# Altium schematic sheet LoadCell_Driver.SchDoc
size Letter; Author: Lihong; Chenwei; SheetNumber: 8; SheetTotal: 8
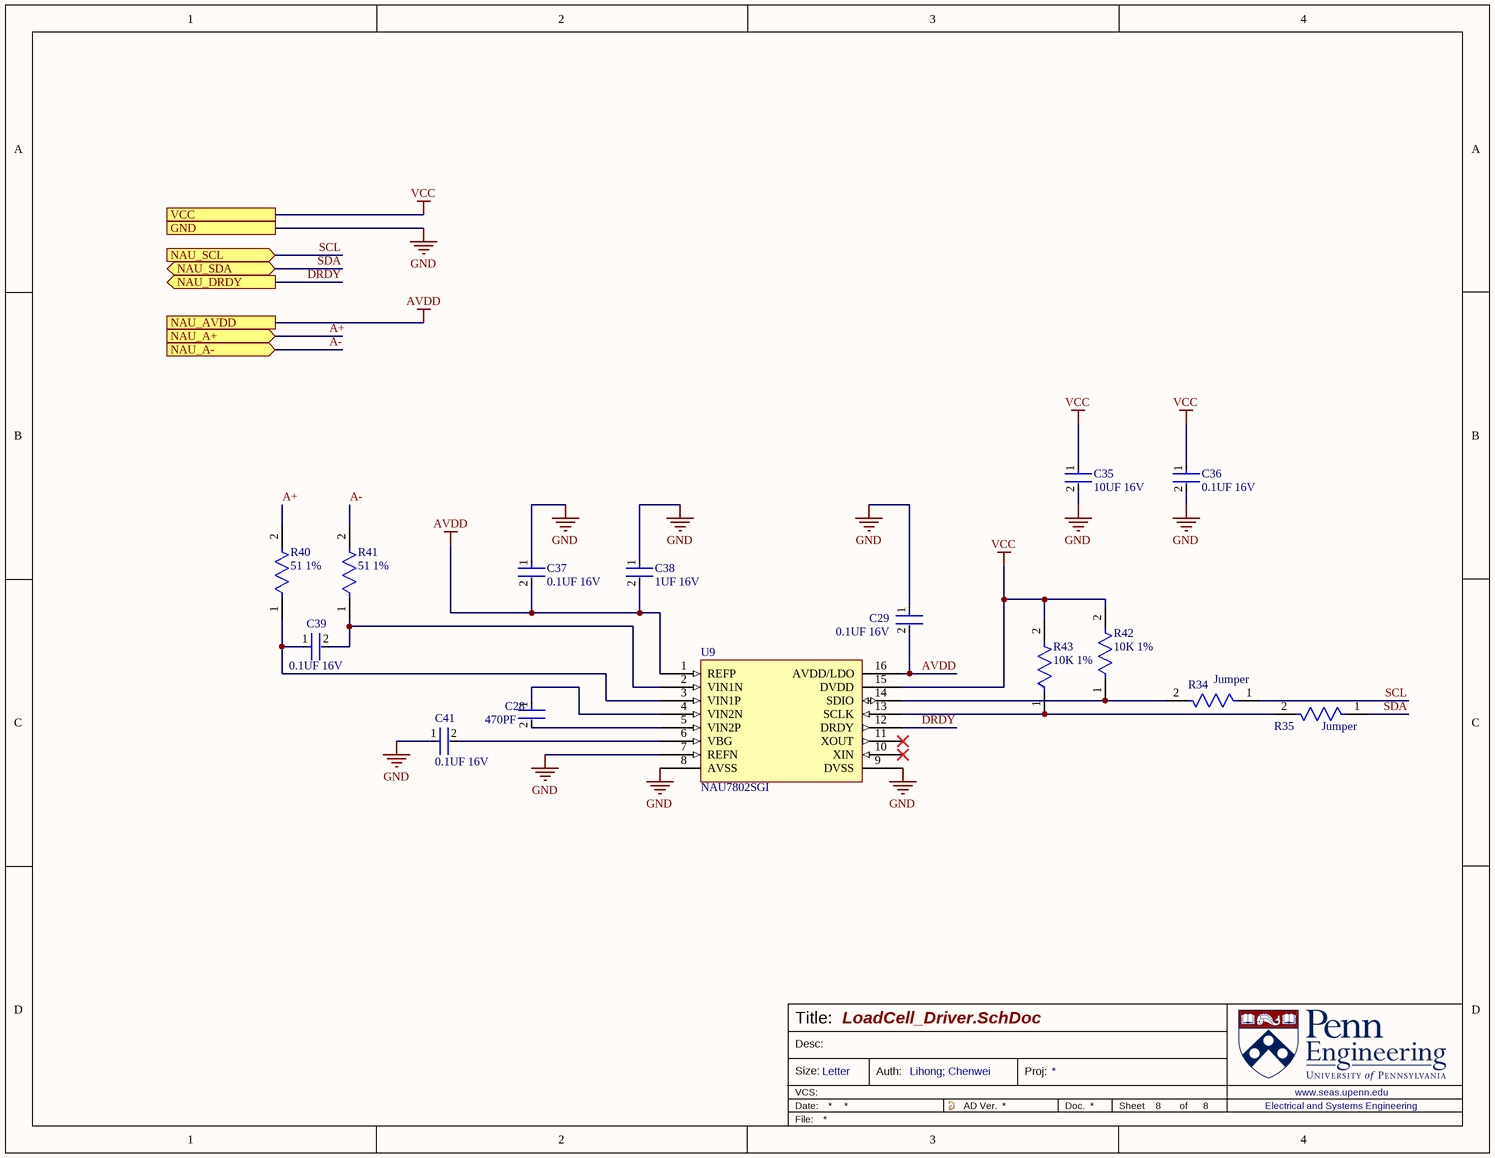
[diagram p0: LoadCell_Driver.SchDoc]

## Parts
C28  470PF  [FP-0402-L_1_0_1-W_0_5_0_1-IPC_A]
C29  0.1UF 16V  [FP-CC0402-MFG]
C35  10UF 16V  [FP-CC0603-DB-MFG]
C36  0.1UF 16V  [FP-CC0402-MFG]
C37  0.1UF 16V  [FP-CC0402-MFG]
C38  1UF 16V  [FP-CC0603-DA-MFG]
C39  0.1UF 16V  [FP-CC0402-MFG]
C41  0.1UF 16V  [FP-CC0402-MFG]
R34  Jumper  [FP-RMCF0603-MFG]
R35  Jumper  [FP-RMCF0603-MFG]
R40  51 1%  [FP-RMCF0402-IPC_C]
R41  51 1%  [FP-RMCF0402-IPC_C]
R42  10K 1%  [FP-RNCP0603-IPC_A]
R43  10K 1%  [FP-RNCP0603-IPC_A]
U9  NAU7802SGI  [SOP127P600X175-16N]

## Ports
GND, NAU_A+ (in), NAU_A- (in), NAU_AVDD, NAU_DRDY (out), NAU_SCL (in), NAU_SDA (bidir), VCC

## Nets
AVDD: C29.2 C37.2 C38.2 U9.1(REFP) U9.16(AVDD/LDO) ; port NAU_AVDD
GND: C29.1 C35.2 C36.2 C37.1 C38.1 C41.1 U9.7(REFN) U9.8(AVSS) U9.9(DVSS) ; port GND
VCC: C35.1 C36.1 R42.2 R43.2 U9.15(DVDD) ; port VCC
A+: R40.2 ; port NAU_A+
A-: R41.2 ; port NAU_A-
DRDY: U9.12(DRDY) ; port NAU_DRDY
SCL: R34.1 ; port NAU_SCL
SDA: R35.1 ; port NAU_SDA
NetC28_1: C28.1 U9.4(VIN2N)
NetC28_2: C28.2 U9.5(VIN2P)
NetC39_1: C39.1 R40.1 U9.3(VIN1P)
NetC39_2: C39.2 R41.1 U9.2(VIN1N)
NetC41_2: C41.2 U9.6(VBG)
NetR34_2: R34.2 R42.1 U9.14(SDIO)
NetR35_2: R35.2 R43.1 U9.13(SCLK)

Not connected (* = marked no-connect by the designer): U9 10(XIN)* 11(XOUT)*

## Notes on the sheet
- Title:
- Desc:
- Size:
- Letter
- Auth:
- Proj:
- Sheet
- of
- www.seas.upenn.edu
- Electrical and Systems Engineering

## Library data of the parts
C28 = CMP-1034-01502-3: General Purpose Ceramic Capacitor, 0402, 470pF, 10%, X7R, 15%, 50V; Series: -; Height: 0.5mm; Termination: SMD/SMT; Packaging: Tape and Reel; Tolerance: 10%; REACH SVHC: No SVHC; Package Quantity: 10000; Case Code (Imperial): 0402; Voltage: 50V; Depth: 0.5mm; Case Code (Metric): 1005; Voltage Rating: 50V; Radiation Hardening: No; Construction: Flat; Mount: Surface Mount; Dielectric: X7R; Min Operating Temperature: -55°C; Width: 0.5mm; Number of Pins: 2; Case/Package: 0402; RoHS Compliant: Yes; Thickness: 0.022inch; Lead Free: Lead Free; Voltage Rating (DC): 50V; Max Operating Temperature: 125°C; Capacitance: 470pF; Length: 1mm; Contact Plating: Tin
C29 C36 C37 C39 C41 = CMP-03422-000946-1: CC0402 100 nF X7R 10.00% 25 V; Manufacturer Part Number: CC0402KPX7R8BB104; Manufacturer: YAGEO; Capacitance: 100 nF; Material: Ceramic; Tolerance: 0.1; Value: 100 nF; Temperature Coefficient: 30ppm/°C; Automotive Grade: NA; Voltage Rating: 25 V; Footprint Url: http://www.yageo.com/exep/pages/download/literatures/UPY-C_GEN_24.pdf; ComponentLink2Description: Datasheet; Device Class L2: Capacitors; Device Class L3: Ceramic Capacitors; Height: 0.55mm; Ipc Land Pattern Name: CAPC10050X50; Category: Cap; ComponentLink2URL: http://www.yageo.com/documents/recent/UPY-GP_NP0_16V-to-50V_16.pdf; Automotive: No; Temperature: -55°C to +125°C; Lead Free: Yes; Temperature Range High: +125°C; Temperature Range Low: -55°C; Temperature Characteristic: X7R; Package: CC0402; RoHS: TRUE; Octopart: https://octopart.com/cc0402kpx7r8bb104-yageo-61757486; Device Class L1: Passive Components
C35 = CMP-1035-02797-2: CAP CER 10UF 6.3V X5R 0603; Dissipation Factor: 10%; Tolerance: 20%; Depth: 0.8mm; Dielectric: X5R; Height: 0.8mm; Min Operating Temperature: -55°C; Package Quantity: 4000; Radiation Hardening: No; Mount: Surface Mount; Termination: SMD/SMT; Case/Package: 0603; Max Operating Temperature: 85°C; Case Code (Imperial): 0603; RoHS Compliant: Yes; Number of Pins: 2; Lead Free: Lead Free; Resistor Type: Ceramic; Thickness: 0.039inch; Construction: Flat; Width: 0.031inch; Length: 1.6mm; Capacitance: 10uF; Voltage Rating: 6.3V; Series: CC; REACH SVHC: No SVHC; Packaging: Tape and Reel; Case Code (Metric): 1608; Voltage Rating (DC): 6.3V; Halogen Free: Halogen Free
C38 = CMP-03422-001047-1: CC0603 1 uF X7R 10.00% 16 V; Manufacturer: YAGEO; Manufacturer Part Number: CC0603KPX7R7BB105; Temperature Coefficient: 15%; Tolerance: 0.1; Material: Ceramic; Device Class L3: Ceramic Capacitors; Temperature Characteristic: X7R; Device Class L2: Capacitors; Temperature Range Low: -55°C; Footprint Url: http://www.yageo.com/exep/pages/download/literatures/UPY-C_GEN_24.pdf; Device Class L1: Passive Components; Temperature: -55°C to +125°C; Voltage Rating: 16 V; RoHS: TRUE; ComponentLink2URL: http://www.yageo.com/documents/recent/UPY-GPHC_X7R_6.3V-to-50V_18.pdf; Mouser Description: Cap Ceramic 1uF 16V X7R 10% SMD 0603 125°C Paper T/R; Octopart: https://octopart.com/cc0603kpx7r7bb105-yageo-25629533; Automotive: No; Capacitance: 1 uF; Height: 0.9mm; Voltage: 16 V; Lead Free: Yes; Category: Cap; Package: CC0603-DA; Temperature Range High: +125°C; Value: 1 uF; ComponentLink2Description: Datasheet
R34 R35 = CMP-26527-000011-1: RES 0 OHM JUMPER 1/10W 0603; Manufacturer Part Number: RMCF0603ZT0R00; Manufacturer: Stackpole; Power Rating: 0.1W; Voltage Rating: 75V; Resistance: 0mΩ; Automotive Grade: Grade 0; Value: 0mΩ; Series: RMCF; Device Class L1: Passive Components; Device Class L3: Chip SMD Resistors; Octopart: https://octopart.com/rmcf0603zt0r00-stackpole+electronics-19213618; Temperature: -55°C to +155°C; Lead Free: Yes; ComponentLink2URL: https://www.seielect.com/catalog/sei-rmcf_rmcp.pdf; Height: 0.55mm; Composition: Thick Film; Package: RMCF0603; Automotive: Yes; Temperature Range High: +155°C; Ipc Land Pattern Name: RESC15580X45; Digikey Description: RES 0 OHM JUMPER 1/10W 0603; RoHS: TRUE; ComponentLink2Description: Datasheet; Temperature Range Low: -55°C; Category: Res; Device Class L2: Resistors
R40 R41 = CMP-26527-001784-1: 51Ω ±1% 0.063W 0402 Thick Film Chip Resistor AEC-Q200 compliant; Resistance: 51R; Temperature Coefficient: 100ppm/°C; Max Power Dissipation: 63mW; RoHS Compliant: Yes; Series: RMCF; Packaging: Cut Tape; Contact Plating: Tin; Length: 0.039inch; Resistor Type: Thick Film; Mount: Surface Mount; Max Operating Temperature: 155°C; Lead Free: Contains Lead; Case/Package: 0402; Case Code (Metric): 1005; Min Operating Temperature: -55°C; Width: 0.02inch; Case Code (Imperial): 0402; Package Quantity: 1; Tolerance: 1%; Number of Terminations: 2; Features: Automotive AEC-Q200; Height: 0.016inch
R42 R43 = CMP-26527-000099-1: 10kΩ ±1% 0.125W 0603 High Power Anti-Sulfur Thin Film Chip Resistor; Resistance: 10kR; Max Power Dissipation: 125mW; Temperature Coefficient: 100ppm/°C; Max Operating Temperature: 155°C; Width: 0.031inch; Height: 0.02inch; Lead Free: Lead Free; Contact Plating: Tin; Tolerance: 1%; Resistor Type: Thin Film; Series: RNCP; RoHS Compliant: Yes; Features: Moisture Resistant; Min Operating Temperature: -55°C; Case Code (Metric): 1608; Case/Package: 0603; Mount: Surface Mount; Packaging: Tape and Reel; Radiation Hardening: No; Length: 0.059inch; Number of Terminations: 2; Case Code (Imperial): 0603
U9 = CMP-00103-2: ADC, Delta-Sigma, 24-Bit, 1 Func, 2 Channel, Serial Access, PDSO16